# EAGLE design ramanPi_imagingBoard (EAGLE 6.2)
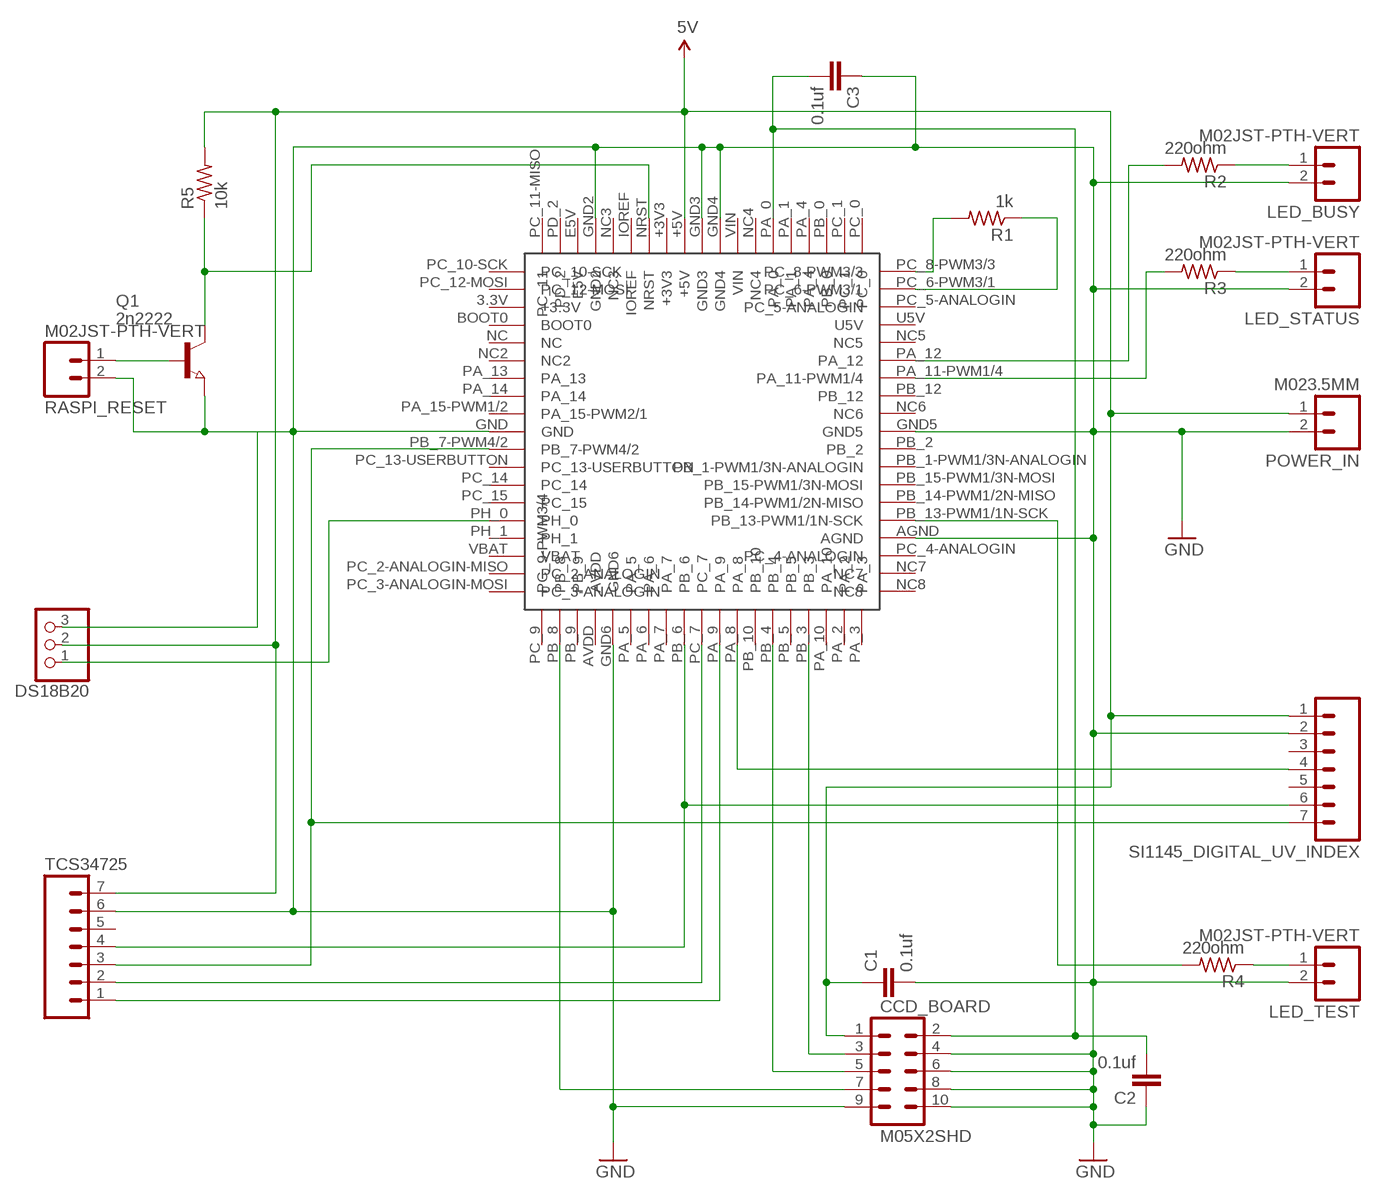
[diagram p0: schematic, sheet 1]

## Parts
C1  0.1uf  CAP1210  [1210]
C2  0.1uf  CAP1210  [1210]
C3  0.1uf  CAP1210  [1210]
CCD_BOARD  M05X2SHD  [2X5-SHROUDED]
DS18B20  PINHD-1X3  [1X03]
LED_BUSY  M02JST-PTH-VERT  [JST-2-PTH-VERT]
LED_STATUS  M02JST-PTH-VERT  [JST-2-PTH-VERT]
LED_TEST  M02JST-PTH-VERT  [JST-2-PTH-VERT]
POWER_IN  M023.5MM  [SCREWTERMINAL-3.5MM-2]
Q1  2n2222  NPN-TRANSISTOR_SOT23  [SOT23]
R1  1k  R-US_M1206  [M1206]
R2  220ohm  R-US_M1206  [M1206]
R3  220ohm  R-US_M1206  [M1206]
R4  220ohm  R-US_M1206  [M1206]
R5  10k  R-US_M1206  [M1206]
RASPI_RESET  M02JST-PTH-VERT  [JST-2-PTH-VERT]
SI1145_DIGITAL_UV_INDEX  M07LOCK  [1X07_LOCK]
TCS34725  M07  [1X07]
U$1  STNUCLEOF401RE  [F401-RE]

## Nets
5V: C1.1 CCD_BOARD.1 DS18B20.2 POWER_IN.1 R5.2 SI1145_DIGITAL_UV_INDEX.1 TCS34725.7 U$1.+5V
GND: C1.2 C2.1 C3.1 CCD_BOARD.4 CCD_BOARD.6 CCD_BOARD.8 CCD_BOARD.9 CCD_BOARD.10 DS18B20.3 LED_BUSY.2 LED_STATUS.2 LED_TEST.2 POWER_IN.2 Q1.2(E) RASPI_RESET.2 SI1145_DIGITAL_UV_INDEX.2 TCS34725.6 U$1.AGND U$1.GND U$1.GND2 U$1.GND3 U$1.GND4 U$1.GND5 U$1.GND6
N$1: CCD_BOARD.7 U$1.PB_8
N$2: CCD_BOARD.5 U$1.PB_4
N$3: Q1.1(B) RASPI_RESET.1
N$4: R1.2 U$1.PC_8-PWM3/3
N$5: R1.1 U$1.PC_6-PWM3/1
N$6: DS18B20.1 U$1.PH_0
N$7: SI1145_DIGITAL_UV_INDEX.7 TCS34725.3 U$1.PB_7-PWM4/2
N$8: SI1145_DIGITAL_UV_INDEX.6 TCS34725.4 U$1.PB_6
N$9: C2.2 C3.2 CCD_BOARD.2 U$1.PA_0
N$10: SI1145_DIGITAL_UV_INDEX.4 U$1.PA_8
N$11: TCS34725.2 U$1.PC_7
N$12: TCS34725.1 U$1.PA_9
N$13: LED_BUSY.1 R2.1
N$14: LED_STATUS.1 R3.1
N$15: LED_TEST.1 R4.1
N$16: R2.2 U$1.PA_12
N$17: R3.2 U$1.PA_11-PWM1/4
N$18: R4.2 U$1.PB_13-PWM1/1N-SCK
N$19: Q1.3(C) R5.1 U$1.NRST
N$20: CCD_BOARD.3 U$1.PB_3
Unconnected: SI1145_DIGITAL_UV_INDEX.3 SI1145_DIGITAL_UV_INDEX.5 TCS34725.5 U$1.BOOT0 U$1.IOREF U$1.NC U$1.NC2 U$1.NC3 U$1.NC4 U$1.NC5 U$1.NC6 U$1.NC7 U$1.NC8 U$1.PA_1 U$1.PA_2 U$1.PA_3 U$1.PA_4 U$1.PA_5 U$1.PA_6 U$1.PA_7 U$1.PA_10 U$1.PA_13 U$1.PA_14 U$1.PA_15-PWM1/2(PA_15-PWM2/1) U$1.PB_0 U$1.PB_1-PWM1/3N-ANALOGIN U$1.PB_2 U$1.PB_5 U$1.PB_9 U$1.PB_10 U$1.PB_12 U$1.PB_14-PWM1/2N-MISO U$1.PB_15-PWM1/3N-MOSI U$1.PC_0 U$1.PC_1 U$1.PC_2-ANALOGIN-MISO(PC_2-ANALOGIN) U$1.PC_3-ANALOGIN-MOSI(PC_3-ANALOGIN) U$1.PC_4-ANALOGIN U$1.PC_5-ANALOGIN U$1.PC_9(PC_9-PWM3/4) U$1.PC_10-SCK U$1.PC_11-MISO(PC_11) U$1.PC_12-MOSI U$1.PC_13-USERBUTTON U$1.PC_14 U$1.PC_15 U$1.PD_2 U$1.PH_1

## Power pins joined to a net without a drawn wire
+3.3V: U$1.3.3V(+3.3V)
+3V3: U$1.+3V3
AVDD: U$1.AVDD
E5V: U$1.E5V
U5V: U$1.U5V
VBAT: U$1.VBAT
VIN: U$1.VIN

## Library data of the parts
C1-C3 = SparkFun-Capacitors:CAP: Capacitor Standard 0603 ceramic capacitor, and 0.1" leaded capacitor.
CCD_BOARD = SparkFun-Connectors:M05X2: Header 5x2 Standard 10-pin dual row 0.1" header. Commonly used with AVR-ISP. Use with Spark Fun Electronics SKU: PRT-00778
DS18B20 = adafruit:PINHD-1X3: PIN HEADER
LED_BUSY LED_STATUS LED_TEST POWER_IN RASPI_RESET = SparkFun-Connectors:M02: Standard 2-pin 0.1" header. Use with - straight break away headers ( PRT-00116) - right angle break away headers (PRT-00553) - swiss pins (PRT-00743) - machine pins (PRT-00117) - female headers (PRT-00115) Molex polarized connector foot print use with: PRT-08233 with associated crimp pins and housings. 2.54_SCREWTERM for use with PRT-10571. 3.5mm Screw Terminal footprints for PRT-08084 5mm Screw Terminal footprints for use with PRT-08433
Q1 = semicon-smd-ipc:NPN-TRANSISTOR_: NPN TRANSISTOR
R1-R5 = adafruit:R-US_: RESISTOR, American symbol
SI1145_DIGITAL_UV_INDEX TCS34725 = SparkFun-Connectors:M07: Header 7 Standard 7-pin 0.1" header. Use with straight break away headers (SKU : PRT-00116), right angle break away headers (PRT-00553), swiss pins (PRT-00743), machine pins (PRT-00117), and female headers (PRT-00115). NOTES ON THE VARIANTS LOCK and LOCK_LONGPADS... This footprint was designed to help hold the alignment of a through-hole component (i.e. 7-pin header) while soldering it into place. You may notice that each hole has been shifted either up or down by 0.005 of an inch from it's more standard position (which is usually a perfectly straight line). This slight alteration caused the pins (the squares in the middle) to touch the edges of the holes. Because they are alternating, it causes a "brace" to hold the header in place. 0.005 has proven to be the perfect amount of "off-center" position when using our standard breakaway headers. Although looks a little odd when you look at the bare footprint, once you have a header in there, the alteration is very hard to notice. Also, if you push a header all the way into place, it is covered up entirely on the bottom side. This idea of altering the position of holes to aid alignment will be further integrated into the Sparkfun Library for other footprints. It can help hold any component with 3 or more connection pins.
U$1 = nucleoF401RE:STNUCLEOF401RE

## Board
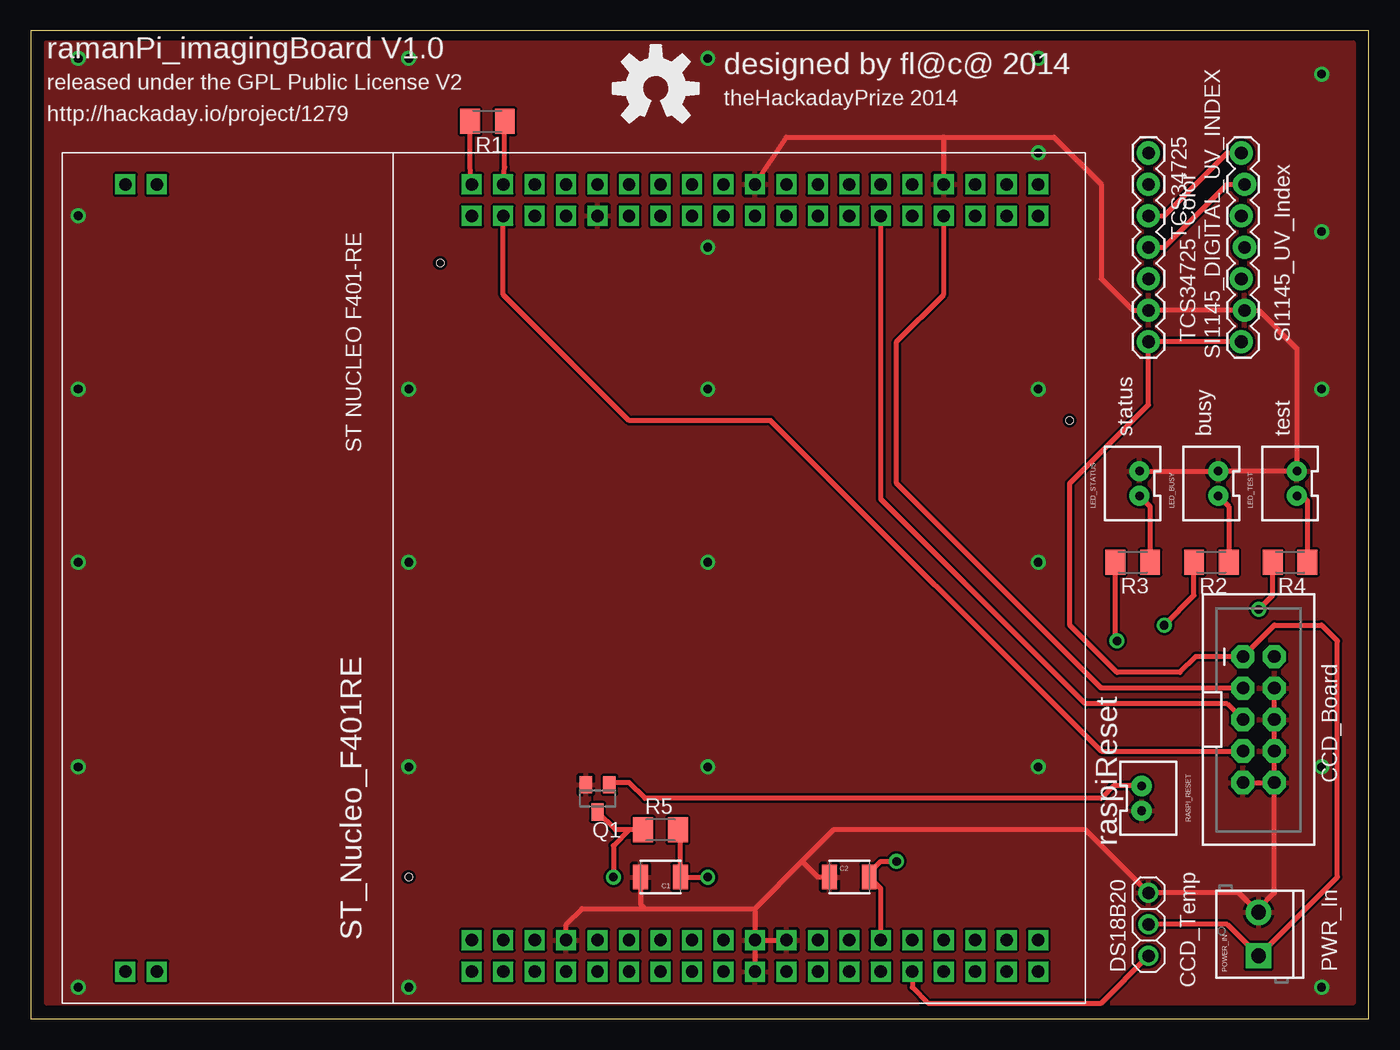
[diagram p1: board, top side]
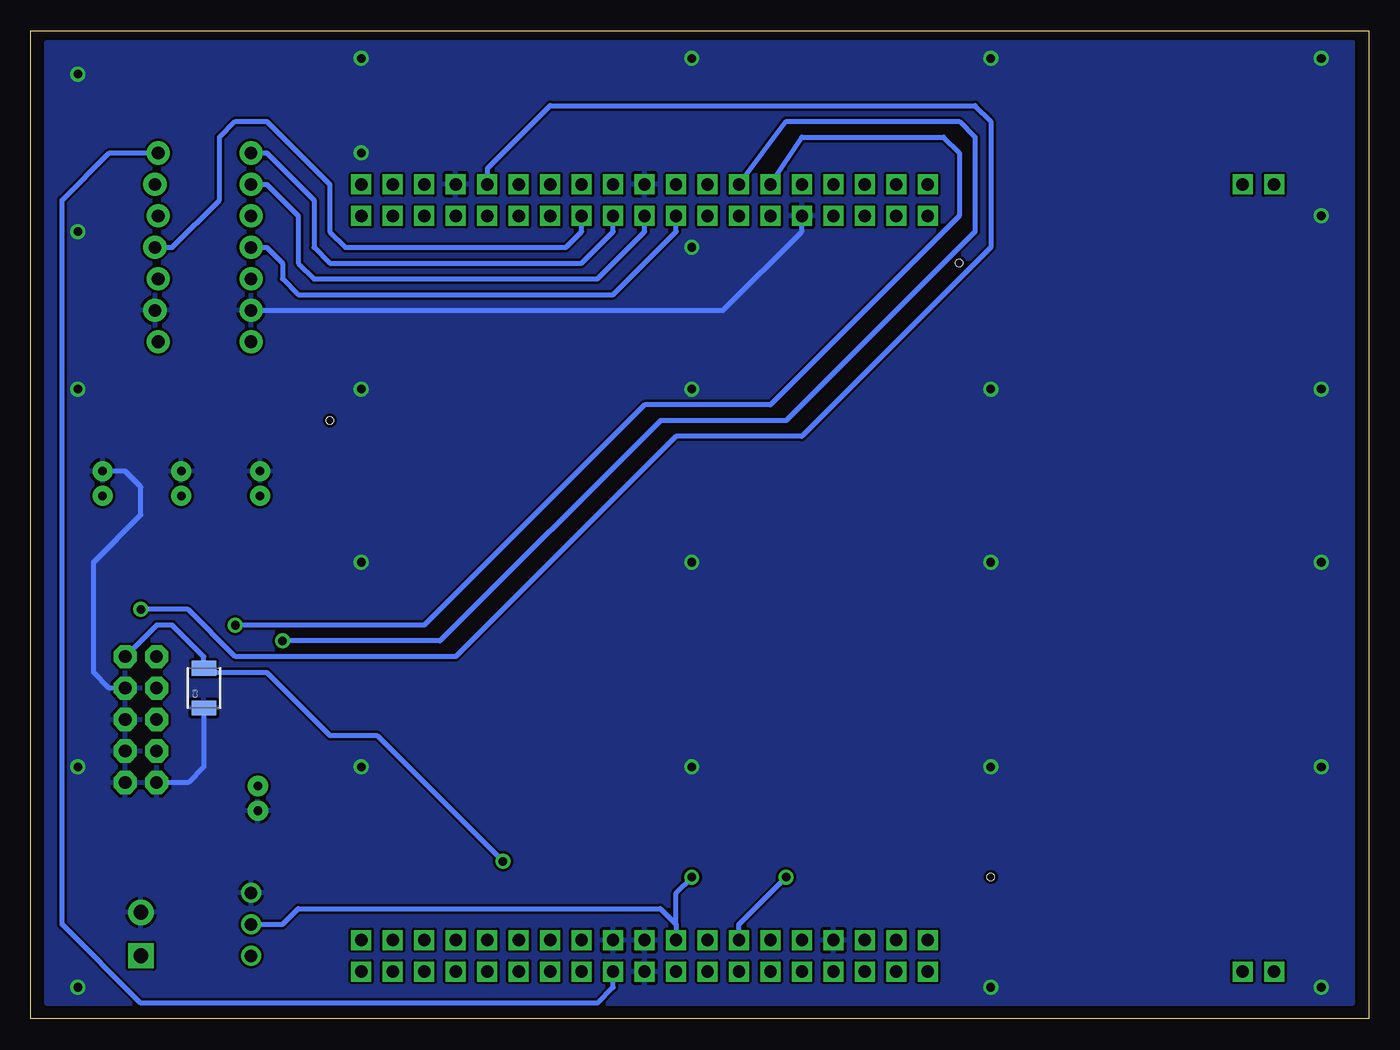
[diagram p2: board, bottom side, seen from below]

Size 107.93 x 79.68 mm. Coordinates in mm from the lower left corner, seen from the top.
Outline: 0,0 107.93,0 107.93,79.68 0,79.68 0,0
Copper layers (1*16): Top 0.035mm / dielectric 1.5mm / Bottom 0.035mm
Design rules: minimum track width 8mil, minimum drill 20mil, track to track 8mil, track to pad 8mil, pad to pad 8mil, via to via 8mil, smd to smd 8mil, copper to edge 10mil, drill to drill 8mil, minimum pad ring 12mil, minimum via ring 10mil, stop-mask expansion 4mil, vias tented up to drill 25mil, thermal gap 10mil

### Footprints (pad centres in the part's own frame; a part is rotated, then mirrored left to right if it is on the bottom)
1210 = smd 1.2 x 2: 1 -1.6,0; 2 1.6,0
2X5-SHROUDED = drill 1.016 pad 1.88 octagon: 1 -1.27,5.08; 2 1.27,5.08; 3 -1.27,2.54; 4 1.27,2.54; 5 -1.27,0; 6 1.27,0; 7 -1.27,-2.54; 8 1.27,-2.54; 9 -1.27,-5.08; 10 1.27,-5.08
1X03 = drill 1.016: 1 -2.54,0; 2 0,0; 3 2.54,0
JST-2-PTH-VERT = drill 0.7 pad 1.626: 1 -1,-0.55; 2 1,-0.55
SCREWTERMINAL-3.5MM-2 = drill 1.2 pad 2.032 square: 1 0,0 | drill 1.2 pad 2.032: 2 3.5,0
SOT23 = smd 1 x 1.4: 1 -0.95,-1.1; 2 0.95,-1.1; 3 0,1.1
M1206 = smd 1.6 x 2: 1 -1.4,0; 2 1.4,0
1X07_LOCK = drill 1.016 pad 1.88: 1 0,0.127; 2 2.54,-0.127; 3 5.08,0.127; 4 7.62,-0.127; 5 10.16,0.127; 6 12.7,-0.127; 7 15.24,0.127
1X07 = drill 1.016 pad 1.88: 1 0,0; 2 2.54,0; 3 5.08,0; 4 7.62,0; 5 10.16,0; 6 12.7,0; 7 15.24,0
F401-RE = drill 1 square: 3.3V 2.54,44.45; +3V3 5.08,31.75; +5V 5.08,29.21; AGND 66.04,11.43; AVDD 63.5,41.91; BOOT0 2.54,41.91; E5V 5.08,44.45; GND 2.54,26.67; GND2 5.08,41.91; GND3 5.08,26.67; GND4 5.08,24.13; GND5 63.5,39.37; GND6 66.04,26.67; IOREF 5.08,36.83; NC 2.54,39.37; NC2 2.54,36.83; NC3 5.08,39.37; NC4 5.08,19.05; NC5 66.04,39.37; NC6 66.04,29.21; NC7 66.04,6.35; NC8 66.04,3.81; NRST 5.08,34.29; P$1 66.04,77.47; P$2 66.04,74.93; P$3 2.54,77.47; P$4 2.54,74.93; PA_0 5.08,16.51; PA_1 5.08,13.97; PA_2 63.5,6.35; PA_3 63.5,3.81; PA_4 5.08,11.43; PA_5 63.5,36.83; PA_6 63.5,34.29; PA_7 63.5,31.75; PA_8 63.5,21.59; PA_9 63.5,24.13; PA_10 63.5,8.89; PA_11-PWM1/4 66.04,34.29; PA_12 66.04,36.83; PA_13 2.54,34.29; PA_14 2.54,31.75; PA_15-PWM1/2 2.54,29.21; PB_0 5.08,8.89; PB_1-PWM1/3N-ANALOGIN 66.04,21.59; PB_2 66.04,24.13; PB_3 63.5,11.43; PB_4 63.5,16.51; PB_5 63.5,13.97; PB_6 63.5,29.21; PB_7-PWM4/2 2.54,24.13; PB_8 63.5,46.99; PB_9 63.5,44.45; PB_10 63.5,19.05; PB_12 66.04,31.75; PB_13-PWM1/1N-SCK 66.04,13.97; PB_14-PWM1/2N-MISO 66.04,16.51; PB_15-PWM1/3N-MOSI 66.04,19.05; PC_0 5.08,3.81; PC_1 5.08,6.35; PC_2-ANALOGIN-MISO 2.54,6.35; PC_3-ANALOGIN-MOSI 2.54,3.81; PC_4-ANALOGIN 66.04,8.89; PC_5-ANALOGIN 66.04,44.45; PC_6-PWM3/1 66.04,46.99; PC_7 63.5,26.67; PC_8-PWM3/3 66.04,49.53; PC_9 63.5,49.53; PC_10-SCK 2.54,49.53; PC_11-MISO 5.08,49.53; PC_12-MOSI 2.54,46.99; PC_13-USERBUTTON 2.54,21.59; PC_14 2.54,19.05; PC_15 2.54,16.51; PD_2 5.08,46.99; PH_0 2.54,13.97; PH_1 2.54,11.43; U5V 66.04,41.91; VBAT 2.54,8.89; VIN 5.08,21.59 | hole 0.6: 46.99,1.27; 10.16,54.61; 59.69,52.07

### Placement (x,y rotation side)
C1  50.8,11.43 180 top
C2  66.04,11.43 0 top
C3  93.98,26.67 90 bottom
CCD_BOARD  99.06,24.13 0 top
DS18B20  90.17,7.62 90 top
LED_BUSY  95.25,43.18 90 top
LED_STATUS  88.9,43.18 90 top
LED_TEST  101.6,43.18 90 top
POWER_IN  99.06,5.08 90 top
Q1  45.72,17.78 180 top
R1  36.83,72.39 180 top
R2  95.25,36.83 180 top
R3  88.9,36.83 180 top
R4  101.6,36.83 180 top
R5  50.8,15.24 0 top
RASPI_RESET  90.17,17.78 270 top
SI1145_DIGITAL_UV_INDEX  97.79,54.61 90 top
TCS34725  90.17,69.85 270 top
U$1  85.09,1.27 90 top
U$2  [OSHW-LOGO-L]  50.41,75.05 0 top

### Tracks (layer width: path | path; a pad name or v marks a point on that pad's centre or on a via)
5V  (via drill 0.7)
  Top 0.406: DS18B20.2 96.52,7.62 POWER_IN.1 105.41,11.43 105.41,30.48 104.14,31.75 100.33,31.75 CCD_BOARD.1 93.98,29.21 92.71,27.94 87.63,27.94 83.82,31.75 83.82,43.18 90.17,49.53 TCS34725.7 SI1145_DIGITAL_UV_INDEX.1 | v54.61,11.43 C1.1 52.4,15.04 R5.2
  Bottom 0.406: DS18B20.2 87.63,7.62 86.36,8.89 57.15,8.89 55.88,7.62 | 55.88,7.62 U$1.+5V | 55.88,7.62 55.88,10.16 v54.61,11.43
GND  (via drill 0.7)
  Top 0.406: U$1.GND3 U$1.GND | U$1.GND3 U$1.GND4 | LED_STATUS.2 LED_BUSY.2 LED_TEST.2 102.15,54.06 99.06,57.15 SI1145_DIGITAL_UV_INDEX.2 TCS34725.6 88.9,57.15 86.36,59.69 86.36,67.31 82.55,71.12 73.66,71.12 | POWER_IN.2 98.75,8.89 | 62.23,12.7 64.77,15.24 85.09,15.24 DS18B20.3 97.48,10.16 98.75,8.89 | 62.23,12.7 58.42,8.89 | 58.42,8.89 U$1.GND3 | 98.75,8.89 99.06,8.89 100.33,10.16 CCD_BOARD.10 | U$1.GND2 43.18,7.62 44.45,8.89 49.53,8.89 | 49.53,8.89 58.42,8.89 | U$1.GND6 60.96,71.12 73.66,71.12 | C2.1 63.5,11.43 62.23,12.7 | C1.2 49.2,9.22 49.53,8.89 | CCD_BOARD.9 CCD_BOARD.10 | CCD_BOARD.10 CCD_BOARD.8 CCD_BOARD.6 CCD_BOARD.4 | U$1.AGND 73.66,71.12
  Bottom 0.406: TCS34725.6 52.07,57.15 45.72,63.5 U$1.GND5 | C3.1 93.98,20.32 95.25,19.05 CCD_BOARD.9 | CCD_BOARD.4 101.6,26.67 102.87,27.94 102.87,36.83 99.06,40.64 99.06,42.91 100.33,44.18 LED_TEST.2
  other vias: 104.14,76.2 3.81,77.47 30.48,77.47 54.61,77.47 81.28,77.47 3.81,64.77 54.61,62.23 81.28,69.85 104.14,63.5 104.14,50.8 81.28,50.8 54.61,50.8 30.48,50.8 3.81,50.8 3.81,36.83 30.48,36.83 54.61,36.83 81.28,36.83 104.14,20.32 81.28,20.32 54.61,20.32 30.48,20.32 3.81,20.32 3.81,2.54 30.48,2.54 104.14,2.54
  pour Top: 1.27,78.74 106.68,78.74 106.68,1.27 1.27,1.27
  pour Bottom: 1.27,78.74 106.68,78.74 106.68,1.27 1.27,1.27
N$1
  Top 0.406: U$1.PB_8 38.1,58.42 48.26,48.26 59.69,48.26 86.36,21.59 CCD_BOARD.7
N$2
  Top 0.406: U$1.PB_4 68.58,41.91 85.09,25.4 96.52,25.4 CCD_BOARD.5
N$3
  Top 0.406: RASPI_RESET.1 87.36,18.78 86.36,17.78 49.53,17.78 48.26,19.05 46.84,19.05 Q1.1
N$4
  Top 0.406: U$1.PC_8-PWM3/3 35.43,68.71 R1.2
N$5
  Top 0.406: U$1.PC_6-PWM3/1 38.23,68.71 R1.1
N$6
  Top 0.406: U$1.PH_0 71.12,2.54 72.39,1.27 86.36,1.27 DS18B20.1
N$7
  Top 0.406: TCS34725.3 91.44,64.77 96.52,69.85 SI1145_DIGITAL_UV_INDEX.7
  Bottom 0.406: SI1145_DIGITAL_UV_INDEX.7 101.6,69.85 105.41,66.04 105.41,7.62 99.06,1.27 62.23,1.27 60.96,2.54 U$1.PB_7-PWM4/2
N$8
  Top 0.406: TCS34725.4 91.44,62.23 96.52,67.31 SI1145_DIGITAL_UV_INDEX.6
  Bottom 0.406: TCS34725.4 88.9,62.23 87.63,60.96 87.63,59.69 86.36,58.42 60.96,58.42 55.88,63.5 U$1.PB_6
N$9  (via drill 0.7)
  Top 0.406: U$1.PA_0 68.58,10.49 C2.2 67.64,11.76 68.58,12.7 v69.85,12.7
  Bottom 0.406: CCD_BOARD.2 97.79,31.75 96.52,31.75 93.98,29.21 C3.2 93.65,27.94 88.9,27.94 83.82,22.86 80.01,22.86 v69.85,12.7
N$10
  Bottom 0.406: SI1145_DIGITAL_UV_INDEX.4 96.52,62.23 92.71,66.04 92.71,71.12 91.44,72.39 88.9,72.39 83.82,67.31 83.82,63.5 82.55,62.23 64.77,62.23 63.5,63.5 U$1.PA_8
N$11
  Bottom 0.406: TCS34725.2 88.9,67.31 86.36,64.77 86.36,60.96 85.09,59.69 62.23,59.69 58.42,63.5 U$1.PC_7
N$12
  Bottom 0.406: TCS34725.1 88.9,69.85 85.09,66.04 85.09,62.23 83.82,60.96 63.5,60.96 60.96,63.5 U$1.PA_9
N$13
  Top 0.406: LED_BUSY.1 96.65,41.33 R2.1
N$14
  Top 0.406: LED_STATUS.1 90.3,41.33 R3.1
N$15
  Top 0.406: LED_TEST.1 102.42,41.91 102.87,41.91 103,41.78 R4.1
N$16  (via drill 0.7)
  Top 0.406: v91.44,31.75 93.85,34.16 R2.2
  Bottom 0.406: U$1.PA_12 45.72,71.12 34.29,71.12 33.02,69.85 33.02,64.77 48.26,49.53 58.42,49.53 76.2,31.75 v91.44,31.75
N$17  (via drill 0.7)
  Top 0.406: 87.63,36.83 R3.2 87.5,30.61 v87.63,30.48
  Bottom 0.406: U$1.PA_11-PWM1/4 46.99,72.39 33.02,72.39 31.75,71.12 31.75,63.5 46.99,48.26 57.15,48.26 74.93,30.48 v87.63,30.48
N$18  (via drill 0.7)
  Top 0.406: v99.06,33.02 100.2,34.16 R4.2
  Bottom 0.406: v99.06,33.02 95.25,33.02 91.44,29.21 73.66,29.21 55.88,46.99 45.72,46.99 30.48,62.23 30.48,72.39 31.75,73.66 66.04,73.66 71.12,68.58 U$1.PB_13-PWM1/1N-SCK
N$19  (via drill 0.7)
  Top 0.406: Q1.3 47.16,15.24 R5.1 48.26,15.24 46.99,13.97 v46.99,11.43
  Bottom 0.406: U$1.NRST 50.8,7.62 v46.99,11.43
N$20
  Top 0.406: CCD_BOARD.3 86.36,26.67 69.85,43.18 69.85,54.61 73.66,58.42 U$1.PB_3

### Text on the board
tPlace: ramanPi_imagingBoard V1.0 | designed by fl@c@ 2014 | released under the GPL Public License V2 | theHackadayPrize 2014 | http://hackaday.io/project/1279 | TCS34725_Color | SI1145_UV_Index | status | busy | test | CCD_Board | raspiReset | ST_Nucleo_F401RE | PWR_In | CCD_Temp